# EAGLE schematic contra4688 (EAGLE 7.5.0)
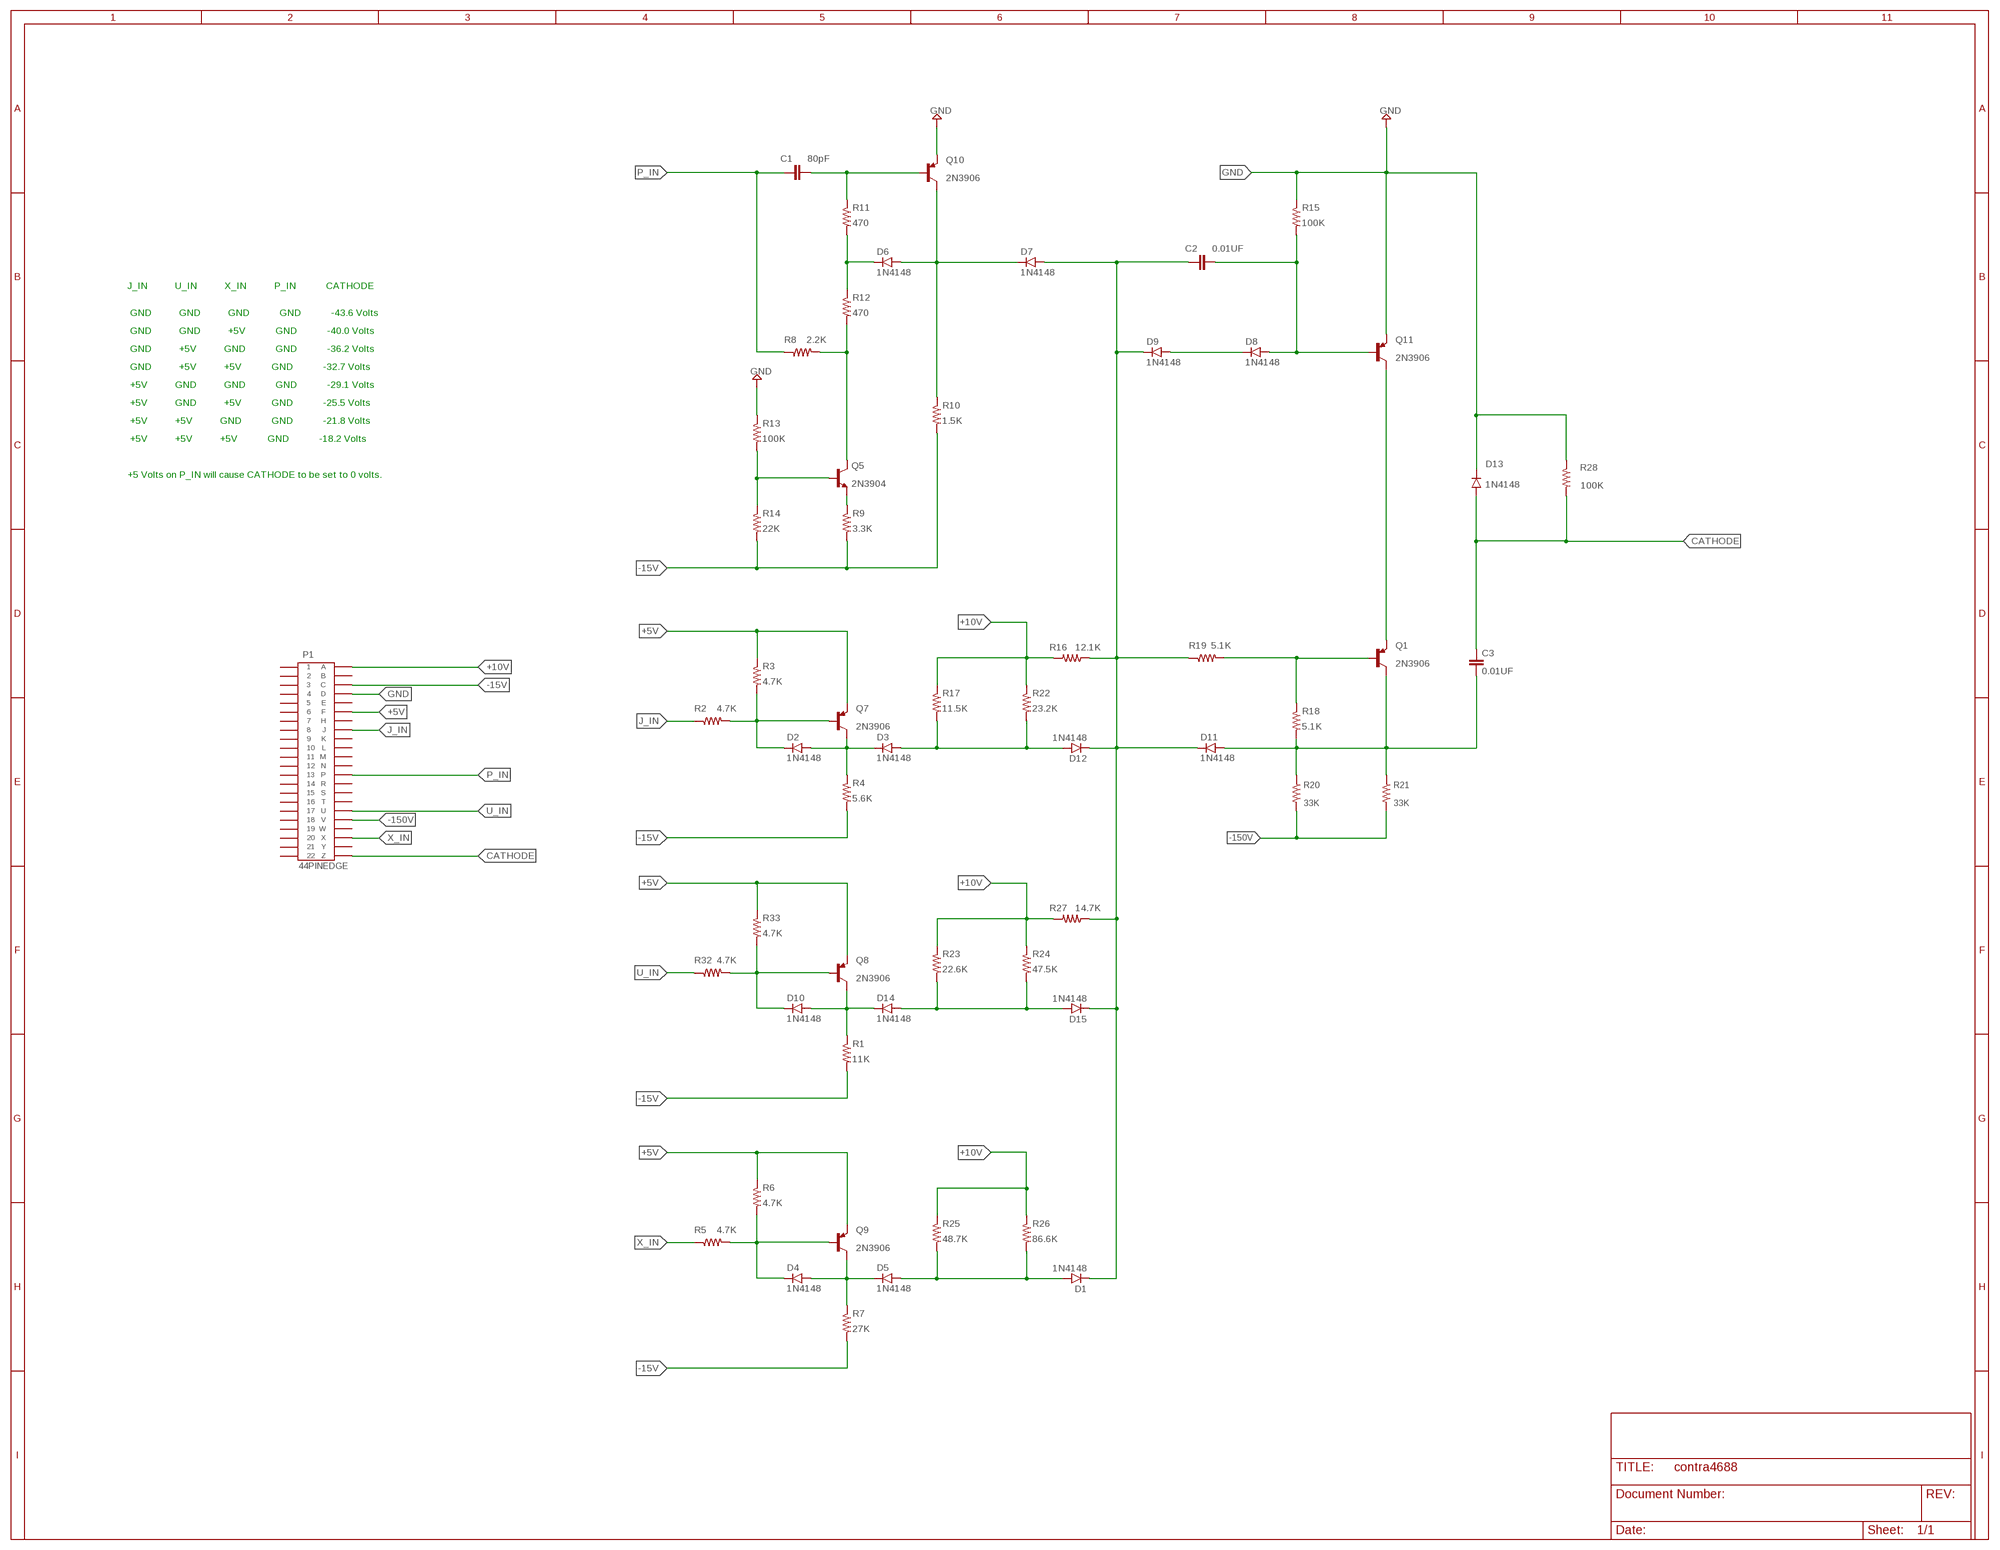
[diagram p0: schematic, sheet 1]

## Parts
C1  80pF  CAP_5MM  [5MM_TH]
C2  0.01UF  CAP_5MM  [5MM_TH]
C3  0.01UF  CAP_5MM  [5MM_TH]
D1  1N4148  [DO35-7]
D2  1N4148  [DO35-7]
D3  1N4148  [DO35-7]
D4  1N4148  [DO35-7]
D5  1N4148  [DO35-7]
D6  1N4148  [DO35-7]
D7  1N4148  [DO35-7]
D8  1N4148  [DO35-7]
D9  1N4148  [DO35-7]
D10  1N4148  [DO35-7]
D11  1N4148  [DO35-7]
D12  1N4148  [DO35-7]
D13  1N4148  [DO35-7]
D14  1N4148  [DO35-7]
D15  1N4148  [DO35-7]
P1  44PINEDGE  [44PINEDGE]
Q1  2N3906  [TO92]
Q5  2N3904  [TO92]
Q7  2N3906  [TO92]
Q8  2N3906  [TO92]
Q9  2N3906  [TO92]
Q10  2N3906  [TO92]
Q11  2N3906  [TO92]
R1  11K  R-1/4WATT  [0207/10]
R2  4.7K  R-1/4WATT  [0207/10]
R3  4.7K  R-1/4WATT  [0207/10]
R4  5.6K  R-1/4WATT  [0207/10]
R5  4.7K  R-1/4WATT  [0207/10]
R6  4.7K  R-1/4WATT  [0207/10]
R7  27K  R-1/4WATT  [0207/10]
R8  2.2K  R-1/4WATT  [0207/10]
R9  3.3K  R-1/4WATT  [0207/10]
R10  1.5K  R-1/4WATT  [0207/10]
R11  470  R-1/4WATT  [0207/10]
R12  470  R-1/4WATT  [0207/10]
R13  100K  R-1/4WATT  [0207/10]
R14  22K  R-1/4WATT  [0207/10]
R15  100K  R-1/4WATT  [0207/10]
R16  12.1K  R-1/4WATT  [0207/10]
R17  11.5K  R-1/4WATT  [0207/10]
R18  5.1K  R-1/4WATT  [0207/10]
R19  5.1K  R-1/4WATT  [0207/10]
R20  33K  RES33K2W  [RR02]
R21  33K  RES33K2W  [RR02]
R22  23.2K  R-1/4WATT  [0207/10]
R23  22.6K  R-1/4WATT  [0207/10]
R24  47.5K  R-1/4WATT  [0207/10]
R25  48.7K  R-1/4WATT  [0207/10]
R26  86.6K  R-1/4WATT  [0207/10]
R27  14.7K  R-1/4WATT  [0207/10]
R28  100K  R-1/4WATT  [0207/10]
R32  4.7K  R-1/4WATT  [0207/10]
R33  4.7K  R-1/4WATT  [0207/10]

## Nets
+5V: P1.F Q7.3(E) Q8.3(E) Q9.3(E) R3.1 R6.1 R33.1
+10V: P1.A R16.2 R17.1 R22.1 R23.1 R24.1 R25.1 R26.1 R27.2
-15V: P1.C R1.2 R4.2 R7.2 R9.2 R10.2 R14.2
-150V: P1.V R20.2 R21.2
CATHODE: C3.1 D13.A P1.Z R28.2
GND: D13.C P1.D Q10.3(E) Q11.3(E) R13.1 R15.1 R28.1
J_IN: P1.J R2.1
N$1: C1.2 Q10.2(B) R11.1
N$2: D2.C Q7.2(B) R2.2 R3.2
N$3: D10.A D14.C Q8.1(C) R1.1
N$4: D2.A D3.C Q7.1(C) R4.1
N$5: D4.C Q9.2(B) R5.2 R6.2
N$6: D4.A D5.C Q9.1(C) R7.1
N$7: D6.A D7.C Q10.1(C) R10.1
N$8: D6.C R11.2 R12.1
N$9: Q5.1(C) R8.2 R12.2
N$10: D3.A D12.A R17.2 R22.2
N$11: Q5.3(E) R9.1
N$12: Q5.2(B) R13.2 R14.1
N$13: D14.A D15.A R23.2 R24.2
N$14: D8.C D9.A
N$15: Q1.3(E) Q11.1(C)
N$17: D1.A D5.A R25.2 R26.2
N$18: Q1.2(B) R18.1 R19.2
N$20: C2.2 D8.A Q11.2(B) R15.2
N$21: C2.1 D1.C D7.A D9.C D11.C D12.C D15.C R16.1 R19.1 R27.1
N$31: D10.C Q8.2(B) R32.2 R33.2
P_IN: C1.1 P1.P R8.1
U_IN: P1.U R32.1
X_IN: P1.X R5.1
Y_OUT: C3.2 D11.A Q1.1(C) R18.2 R20.1 R21.1
Unconnected: P1.1 P1.2 P1.3 P1.4 P1.5 P1.6 P1.7 P1.8 P1.9 P1.10 P1.11 P1.12 P1.13 P1.14 P1.15 P1.16 P1.17 P1.18 P1.19 P1.20 P1.21 P1.22 P1.B P1.E P1.H P1.K P1.L P1.M P1.N P1.R P1.S P1.T P1.W P1.Y

## Notes on the sheet
- J_IN           U_IN           X_IN           P_IN            CATHODE
- GND           GND           GND            GND            -43.6 Volts
- GND           GND           +5V            GND            -40.0 Volts
- GND           +5V           GND            GND            -36.2 Volts
- GND           +5V           +5V            GND            -32.7 Volts
- +5V           GND           GND            GND            -29.1 Volts
- +5V           GND           +5V            GND            -25.5 Volts
- +5V           +5V           GND            GND            -21.8 Volts
- +5V           +5V           +5V            GND            -18.2 Volts
- +5 Volts on P_IN will cause CATHODE to be set to 0 volts.

## Library data of the parts
C1-C3 = keiths:CAP_5MM: Through hole radial, 5m pin spacing.
D1-D15 = keiths:1N4148: High Conductance Fast Diode
P1 = keiths:44PINEDGE: 44 PIN EDGE CONNECTOR FOR PCB
Q1 Q7-Q11 = keiths:2N3906: PNP Transistor
Q5 = keiths:2N3904: NPN Transistor
R1-R19 R22-R28 R32 R33 = keiths:R-1/4WATT: Quarter watt through hole resistor.
R20 R21 = keiths:RES33K2W: Metal Film Resistors - Through Hole 5% 33K TE Connectivity RR02J33KTB